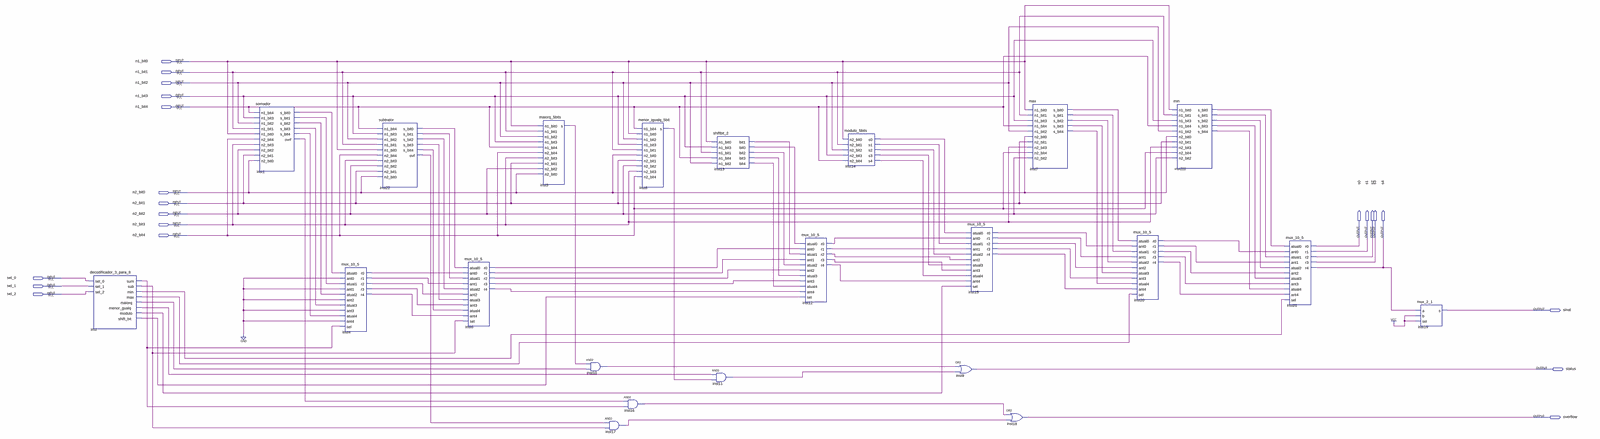
[diagram p0: schematic sheet, whole]
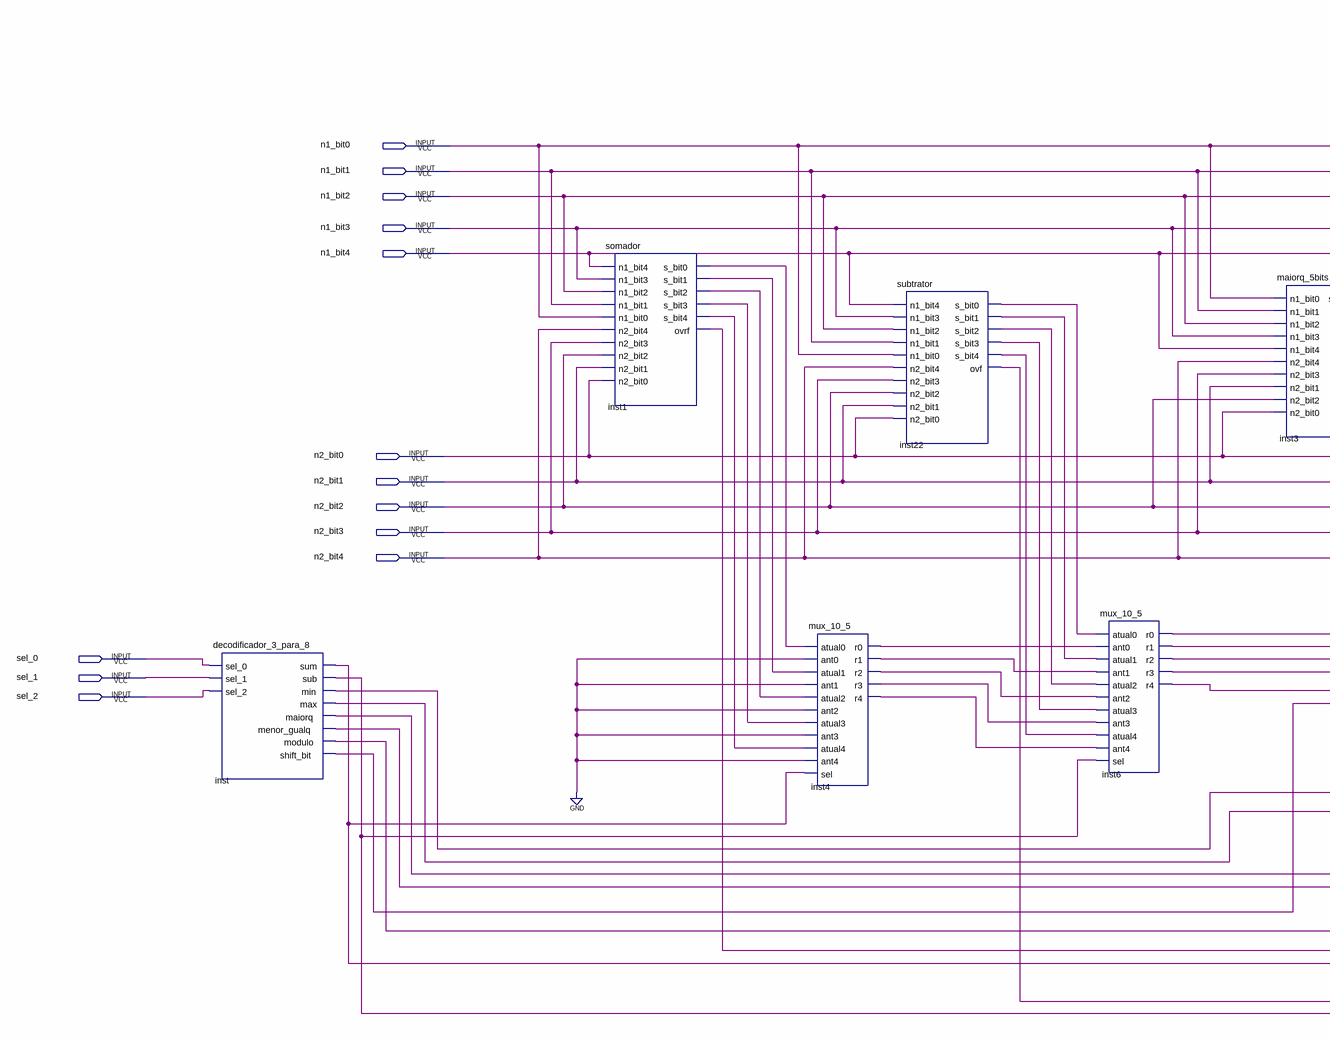
[diagram p1: schematic sheet, left part]
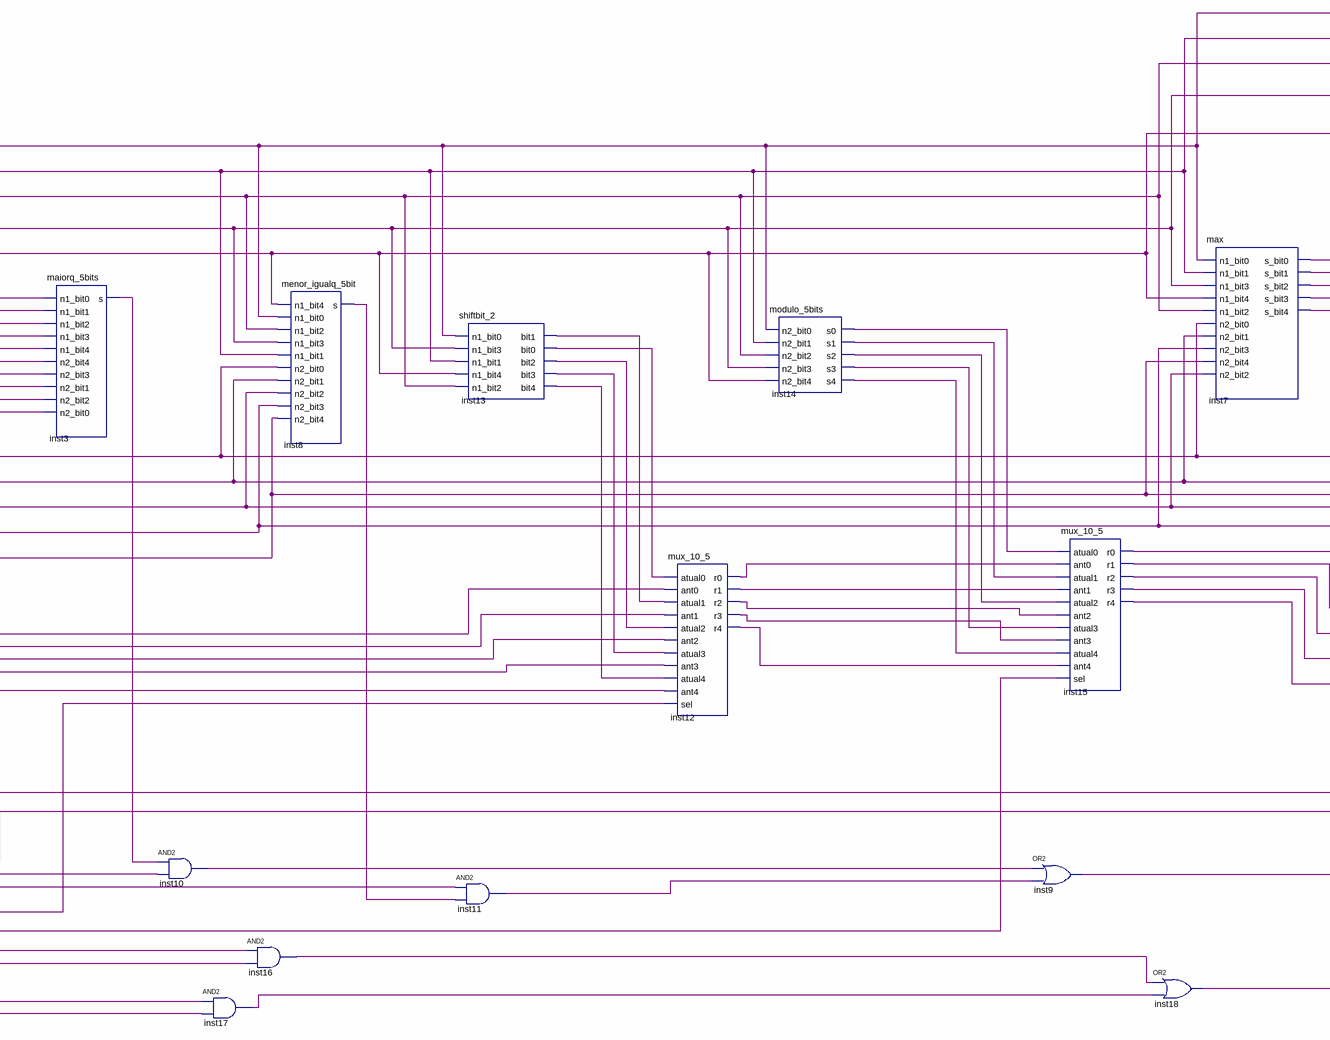
[diagram p2: schematic sheet, centre part]
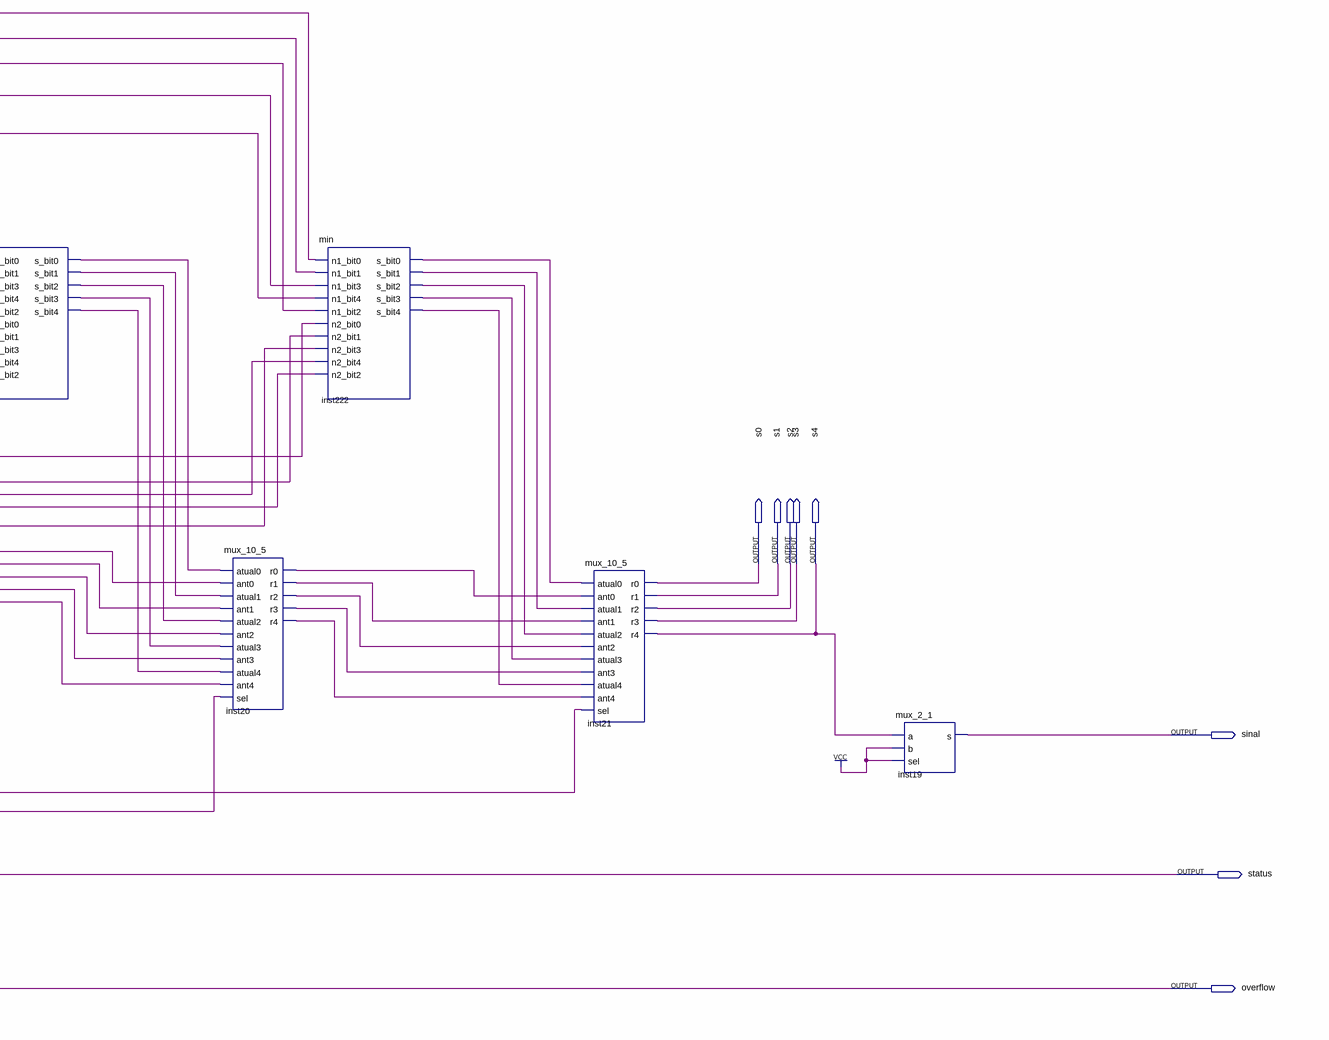
[diagram p3: schematic sheet, right part]
// Quartus schematic ula.bdf as structural Verilog: 22 symbols, 21 pins
module ula (
  input  n1_bit0,
  input  n1_bit1,
  input  n1_bit2,
  input  n1_bit3,
  input  n1_bit4,
  input  n2_bit0,
  input  n2_bit1,
  input  n2_bit2,
  input  n2_bit3,
  input  n2_bit4,
  input  sel_0,
  input  sel_1,
  input  sel_2,
  output s0,
  output s1,
  output s2,
  output s3,
  output s4,
  output sinal,
  output status,
  output overflow
);

  wire inst1_ovrf, inst1_s_bit0, inst1_s_bit1, inst1_s_bit2, inst1_s_bit3, inst1_s_bit4, inst3_s, inst4_r0,
       inst4_r1, inst4_r2, inst4_r3, inst4_r4, inst6_r0, inst6_r1, inst6_r2, inst6_r3, inst6_r4,
       inst7_s_bit0, inst7_s_bit1, inst7_s_bit2, inst7_s_bit3, inst7_s_bit4, inst8_s, inst10_out, inst11_out,
       inst12_r0, inst12_r1, inst12_r2, inst12_r3, inst12_r4, inst13_bit0, inst13_bit1, inst13_bit2,
       inst13_bit3, inst13_bit4, inst14_s0, inst14_s1, inst14_s2, inst14_s3, inst14_s4, inst15_r0, inst15_r1,
       inst15_r2, inst15_r3, inst15_r4, inst16_out, inst17_out, inst20_r0, inst20_r1, inst20_r2, inst20_r3,
       inst20_r4, inst22_ovf, inst22_s_bit0, inst22_s_bit1, inst22_s_bit2, inst22_s_bit3, inst22_s_bit4,
       inst222_s_bit0, inst222_s_bit1, inst222_s_bit2, inst222_s_bit3, inst222_s_bit4, inst_maiorq, inst_max,
       inst_menor_gualq, inst_min, inst_modulo, inst_shift_bit, inst_sub, inst_sum;

  decodificador_3_para_8 inst (
    .sel_0(sel_0), .sel_1(sel_1), .sel_2(sel_2), .sum(inst_sum), .sub(inst_sub), .min(inst_min),
    .max(inst_max), .maiorq(inst_maiorq), .menor_gualq(inst_menor_gualq), .modulo(inst_modulo),
    .shift_bit(inst_shift_bit));
  somador inst1 (
    .n1_bit4(n1_bit4), .n1_bit3(n1_bit3), .n1_bit2(n1_bit2), .n1_bit1(n1_bit1), .n1_bit0(n1_bit0),
    .n2_bit4(n2_bit4), .n2_bit3(n2_bit3), .n2_bit2(n2_bit2), .n2_bit1(n2_bit1), .n2_bit0(n2_bit0),
    .s_bit0(inst1_s_bit0), .s_bit1(inst1_s_bit1), .s_bit2(inst1_s_bit2), .s_bit3(inst1_s_bit3),
    .s_bit4(inst1_s_bit4), .ovrf(inst1_ovrf));
  mux_10_5 inst4 (
    .atual0(inst1_s_bit0), .ant0(1'b0), .atual1(inst1_s_bit1), .ant1(1'b0), .atual2(inst1_s_bit2),
    .ant2(1'b0), .atual3(inst1_s_bit3), .ant3(1'b0), .atual4(inst1_s_bit4), .ant4(1'b0), .sel(inst_sum),
    .r0(inst4_r0), .r1(inst4_r1), .r2(inst4_r2), .r3(inst4_r3), .r4(inst4_r4));
  subtrator inst22 (
    .n1_bit4(n1_bit4), .n1_bit3(n1_bit3), .n1_bit2(n1_bit2), .n1_bit1(n1_bit1), .n1_bit0(n1_bit0),
    .n2_bit4(n2_bit4), .n2_bit3(n2_bit3), .n2_bit2(n2_bit2), .n2_bit1(n2_bit1), .n2_bit0(n2_bit0),
    .s_bit0(inst22_s_bit0), .s_bit1(inst22_s_bit1), .s_bit2(inst22_s_bit2), .s_bit3(inst22_s_bit3),
    .s_bit4(inst22_s_bit4), .ovf(inst22_ovf));
  mux_10_5 inst6 (
    .atual0(inst22_s_bit0), .ant0(inst4_r0), .atual1(inst22_s_bit1), .ant1(inst4_r1), .atual2(inst22_s_bit2),
    .ant2(inst4_r2), .atual3(inst22_s_bit3), .ant3(inst4_r3), .atual4(inst22_s_bit4), .ant4(inst4_r4),
    .sel(inst_sub), .r0(inst6_r0), .r1(inst6_r1), .r2(inst6_r2), .r3(inst6_r3), .r4(inst6_r4));
  maiorq_5bits inst3 (
    .n1_bit0(n1_bit0), .n1_bit1(n1_bit1), .n1_bit2(n1_bit2), .n1_bit3(n1_bit3), .n1_bit4(n1_bit4),
    .n2_bit4(n2_bit4), .n2_bit3(n2_bit3), .n2_bit1(n2_bit1), .n2_bit2(n2_bit2), .n2_bit0(n2_bit0), .s(inst3_s));
  and inst10 (inst10_out, inst3_s, inst_maiorq);
  and inst17 (inst17_out, inst22_ovf, inst_sub);
  menor_igualq_5bit inst8 (
    .n1_bit4(n1_bit4), .n1_bit0(n1_bit0), .n1_bit2(n1_bit2), .n1_bit3(n1_bit3), .n1_bit1(n1_bit1),
    .n2_bit0(n2_bit0), .n2_bit1(n2_bit1), .n2_bit2(n2_bit2), .n2_bit3(n2_bit3), .n2_bit4(n2_bit4), .s(inst8_s));
  and inst16 (inst16_out, inst1_ovrf, inst_sum);
  shiftbit_2 inst13 (
    .n1_bit0(n1_bit0), .n1_bit3(n1_bit3), .n1_bit1(n1_bit1), .n1_bit4(n1_bit4), .n1_bit2(n1_bit2),
    .bit1(inst13_bit1), .bit0(inst13_bit0), .bit2(inst13_bit2), .bit3(inst13_bit3), .bit4(inst13_bit4));
  and inst11 (inst11_out, inst_menor_gualq, inst8_s);
  mux_10_5 inst12 (
    .atual0(inst13_bit0), .ant0(inst6_r0), .atual1(inst13_bit1), .ant1(inst6_r1), .atual2(inst13_bit2),
    .ant2(inst6_r2), .atual3(inst13_bit3), .ant3(inst6_r3), .atual4(inst13_bit4), .ant4(inst6_r4),
    .sel(inst_shift_bit), .r0(inst12_r0), .r1(inst12_r1), .r2(inst12_r2), .r3(inst12_r3), .r4(inst12_r4));
  modulo_5bits inst14 (
    .n2_bit0(n1_bit0), .n2_bit1(n1_bit1), .n2_bit2(n1_bit2), .n2_bit3(n1_bit3), .n2_bit4(n1_bit4),
    .s0(inst14_s0), .s1(inst14_s1), .s2(inst14_s2), .s3(inst14_s3), .s4(inst14_s4));
  or inst9 (status, inst10_out, inst11_out);
  mux_10_5 inst15 (
    .atual0(inst14_s0), .ant0(inst12_r0), .atual1(inst14_s1), .ant1(inst12_r1), .atual2(inst14_s2),
    .ant2(inst12_r2), .atual3(inst14_s3), .ant3(inst12_r3), .atual4(inst14_s4), .ant4(inst12_r4),
    .sel(inst_modulo), .r0(inst15_r0), .r1(inst15_r1), .r2(inst15_r2), .r3(inst15_r3), .r4(inst15_r4));
  or inst18 (overflow, inst16_out, inst17_out);
  max inst7 (
    .n1_bit0(n1_bit0), .n1_bit1(n1_bit1), .n1_bit3(n1_bit3), .n1_bit4(n1_bit4), .n1_bit2(n1_bit2),
    .n2_bit0(n2_bit0), .n2_bit1(n2_bit1), .n2_bit3(n2_bit3), .n2_bit4(n2_bit4), .n2_bit2(n2_bit2),
    .s_bit0(inst7_s_bit0), .s_bit1(inst7_s_bit1), .s_bit2(inst7_s_bit2), .s_bit3(inst7_s_bit3),
    .s_bit4(inst7_s_bit4));
  mux_10_5 inst20 (
    .atual0(inst7_s_bit0), .ant0(inst15_r0), .atual1(inst7_s_bit1), .ant1(inst15_r1), .atual2(inst7_s_bit2),
    .ant2(inst15_r2), .atual3(inst7_s_bit3), .ant3(inst15_r3), .atual4(inst7_s_bit4), .ant4(inst15_r4),
    .sel(inst_max), .r0(inst20_r0), .r1(inst20_r1), .r2(inst20_r2), .r3(inst20_r3), .r4(inst20_r4));
  min inst222 (
    .n1_bit0(n1_bit0), .n1_bit1(n1_bit1), .n1_bit3(n1_bit3), .n1_bit4(n1_bit4), .n1_bit2(n1_bit2),
    .n2_bit0(n2_bit0), .n2_bit1(n2_bit1), .n2_bit3(n2_bit3), .n2_bit4(n2_bit4), .n2_bit2(n2_bit2),
    .s_bit0(inst222_s_bit0), .s_bit1(inst222_s_bit1), .s_bit2(inst222_s_bit2), .s_bit3(inst222_s_bit3),
    .s_bit4(inst222_s_bit4));
  mux_10_5 inst21 (
    .atual0(inst222_s_bit0), .ant0(inst20_r0), .atual1(inst222_s_bit1), .ant1(inst20_r1),
    .atual2(inst222_s_bit2), .ant2(inst20_r2), .atual3(inst222_s_bit3), .ant3(inst20_r3),
    .atual4(inst222_s_bit4), .ant4(inst20_r4), .sel(inst_min), .r0(s0), .r1(s1), .r2(s2), .r3(s3), .r4(s4));
  mux_2_1 inst19 (.a(s4), .b(1'b1), .sel(1'b1), .s(sinal));
endmodule
